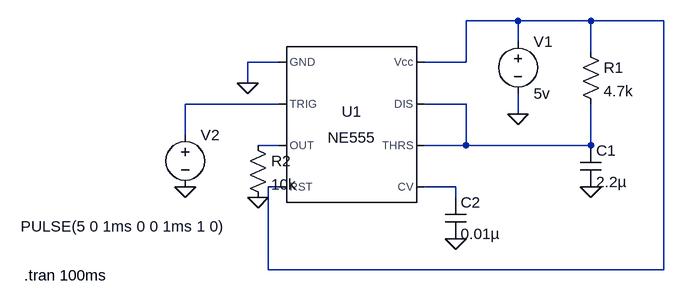
[diagram p0: schematic Monostable.asc]
Monostable.asc, the LTspice schematic file:
Version 4
SHEET 1 880 680
WIRE 480 32 400 32
WIRE 592 32 480 32
WIRE 704 32 592 32
WIRE 480 64 480 32
WIRE 592 80 592 32
WIRE 112 96 64 96
WIRE 400 96 400 32
WIRE 400 96 336 96
WIRE 64 128 64 96
WIRE 112 160 -32 160
WIRE 400 160 336 160
WIRE 480 176 480 144
WIRE -32 208 -32 160
WIRE 112 224 80 224
WIRE 400 224 400 160
WIRE 400 224 336 224
WIRE 592 224 592 160
WIRE 592 224 400 224
WIRE 112 288 96 288
WIRE 384 288 336 288
WIRE 384 304 384 288
WIRE 96 416 96 288
WIRE 704 416 704 32
WIRE 704 416 96 416
FLAG 64 128 0
FLAG 480 176 0
FLAG 592 288 0
FLAG -32 288 0
FLAG 80 304 0
FLAG 384 368 0
SYMBOL Misc\\NE555 224 192 R0
SYMATTR InstName U1
SYMBOL voltage 480 48 R0
SYMATTR InstName V1
SYMATTR Value 5v
SYMBOL res 576 64 R0
SYMATTR InstName R1
SYMATTR Value 4.7k
SYMBOL cap 576 224 R0
SYMATTR InstName C1
SYMATTR Value 2.2µ
SYMBOL voltage -32 192 R0
WINDOW 3 -253 157 Left 2
WINDOW 123 0 0 Left 0
WINDOW 39 0 0 Left 0
SYMATTR InstName V2
SYMATTR Value PULSE(5 0 1ms 0 0 1ms 1 0)
SYMBOL res 64 208 R0
SYMATTR InstName R2
SYMATTR Value 10k
SYMBOL cap 368 304 R0
SYMATTR InstName C2
SYMATTR Value 0.01µ
TEXT -280 424 Left 2 !.tran 100ms

The netlist it stands for:
* Monostable.asc
XU1 0 N002 N004 N001 N005 N003 N003 N001 NE555  ; pins GND TRIG OUT RST CV THRS DIS Vcc
V1 N001 0 5v
R1 N001 N003 4.7k
C1 N003 0 2.2µ
V2 N002 0 PULSE(5 0 1ms 0 0 1ms 1 0)
R2 N004 0 10k
C2 N005 0 0.01µ
.tran 100ms
.lib NE555.sub
.backanno
.end